# EAGLE design go-booster (EAGLE 7.6.0)
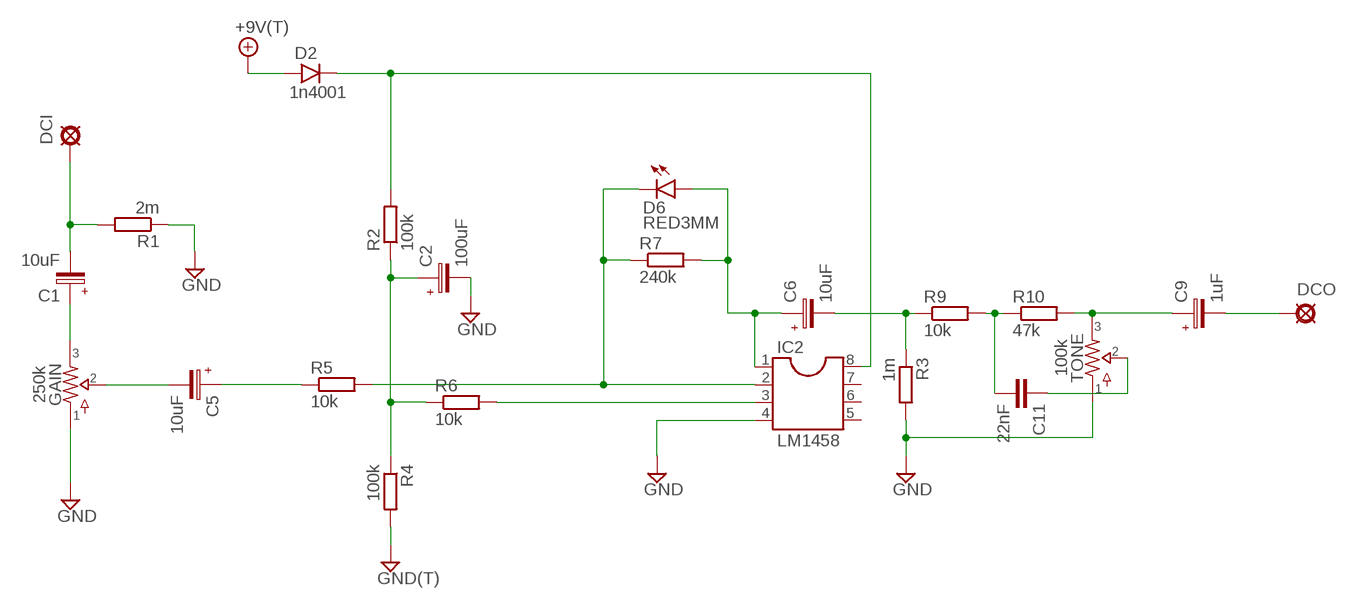
[diagram p0: schematic, sheet 1]

## Parts
+9V2  +9V(T)  [SQUARE]
C1  10uF  050-EU1  [050_020_1]
C2  100uF  050-EU1  [050_020_1]
C5  10uF  050-EU1  [050_020_1]
C6  10uF  050-EU1  [050_020_1]
C9  1uF  050-EU1  [050_020_1]
C11  22nF  072X0252  [072X025]
D2  1n4001  DO41.4  [DO41-4]
D6  RED3MM  LED3MM  [LED3MM]
DCI  IN  PAD8  [OCTOGON]
DCO  OUT  PAD8  [OCTOGON]
GAIN  250k  POTS  [16MM_CENTERMOUNT]
GND11  GND(T)  [SQUARE]
IC2  LM1458  DIL8S  [SOCKET-08]
R1  2m  R-EU_0207/10  [0207/10]
R2  100k  R-EU_0207/10  [0207/10]
R3  1m  R-EU_0207/10  [0207/10]
R4  100k  R-EU_0207/10  [0207/10]
R5  10k  R-EU_0207/10  [0207/10]
R6  10k  R-EU_0207/10  [0207/10]
R7  240k  R-EU_0207/10  [0207/10]
R9  10k  R-EU_0207/10  [0207/10]
R10  47k  R-EU_0207/10  [0207/10]
TONE  100k  POTSTRIM  [2262_TRIM]

## Nets
+9V: +9V2.1(+9V) D2.A
GND: C2.- GAIN.1 GND11.1(GND) IC2.4 R1.1 R3.2 R4.2 TONE.1
N$1: C1.+ GAIN.3
N$2: C1.- DCI.1(PAD) R1.2
N$5: D2.C IC2.8 R2.2
N$6: D6.K(C) IC2.2 R5.2 R7.1
N$7: IC2.3 R6.2
N$8: C6.+ D6.A IC2.1 R7.2
N$9: C5.- GAIN.2
N$10: C2.+ R2.1 R4.1 R6.1
N$11: C6.- R3.1 R9.1
N$13: C5.+ R5.1
N$17: C9.- DCO.1(PAD)
N$23: C11.2 R9.2 R10.1
N$24: C9.+ R10.2 TONE.3
N$25: C11.1 TONE.2
Unconnected: IC2.5 IC2.6 IC2.7

## Library data of the parts
+9V2 = gm-supply:+9V(T): +9V Voltage Supply use this to hook up +9v throughout a schematic instead of running wire automatically labels the net "+9v" adds a hookup pad to the circuit board
C1 C2 C5 C6 C9 = gm-caps-electro-pol:050-EU
C11 = gm-caps-film-box:072X025: 1000pF - 0.47uF WIMA MKP2 63, 100V: 1000pF - 0.015uF; MKS2 50V: 0.33 - 0.47uF; 63V: 1000pF - 0.22uF;
D2 = gm-diodes:DO41: DO-41 Package Diodes: 1N4001 - 1N40019 Zener Diodes: 1N4728 - 1N4764
D6 = gm-diodes:LED
DCI DCO = gm-supply:PAD: PAD use this package for pads with any purpose, including input, output, send or return various pad shapes: round, square, octogonal, long, and long offset
GAIN TONE = potentiometers:POTS
GND11 = gm-supply:GND(T): Ground use this to hook up ground (GND) throughout a schematic instead of running wire automatically labels the net "GND" adds a hookup pad to the circuit board (you can use several)
IC2 = ic-package:DIL8: Dual In Line / Socket
R1-R7 R9 R10 = resistor:R-EU_: RESISTOR, European symbol

## Board
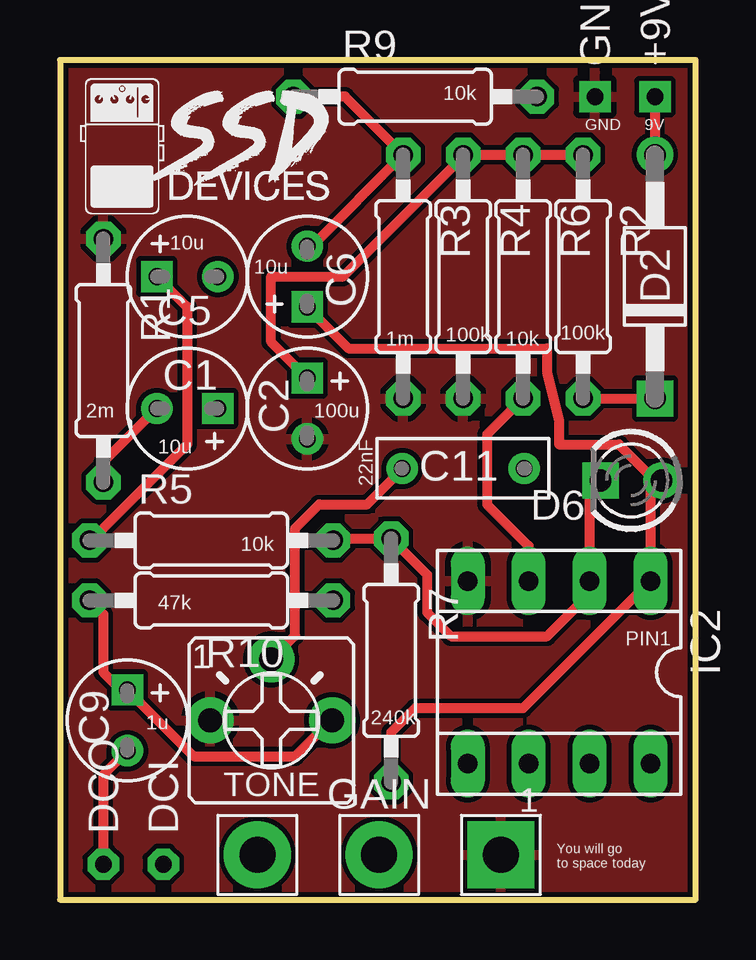
[diagram p1: board, top side]
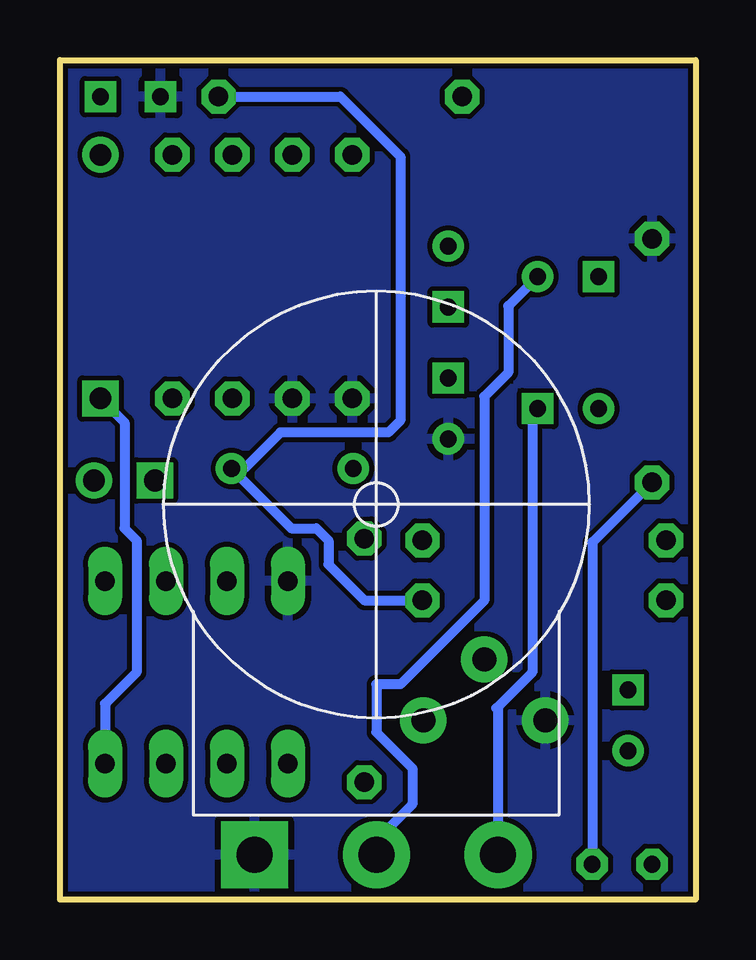
[diagram p2: board, bottom side, seen from below]

Size 26.5 x 35 mm. Coordinates in mm from the lower left corner, seen from the top.
Outline: 0,0 26.5,0 26.5,35 0,35 0,0
Copper layers (1*16): Top 0.035mm / dielectric 1.5mm / Bottom 0.035mm
Design rules "SparkFun": minimum track width 8mil, minimum drill 20mil, track to track 8mil, track to pad 8mil, pad to pad 8mil, via to via 8mil, smd to smd 8mil, copper to edge 8mil, drill to drill 8mil, minimum pad ring 12mil, minimum via ring 10mil, stop-mask expansion 4mil, vias tented up to drill 20mil, thermal gap 10mil

### Footprints (pad centres in the part's own frame; a part is rotated, then mirrored left to right if it is on the bottom)
SQUARE = drill 0.7 square: 1 0,0
050_020_1 = drill 0.7 square: + -1.27,0 | drill 0.7: - 1.27,0
072X025 = drill 0.7: 1 -2.54,0; 2 2.54,0
DO41-4 = drill 0.9: A 5.08,0 | drill 0.9 square: C -5.08,0
LED3MM = drill 0.9: A -1.27,0 | drill 0.9 square: K 1.27,0
OCTOGON = drill 0.7 octagon: 1 0,0
16MM_CENTERMOUNT = drill 1.5 pad 2.794 square: 1 5.08,-14.605 | drill 1.5 pad 2.794: 2 0,-14.605; 3 -5.08,-14.605
SOCKET-08 = drill 0.813 long: 1 -3.81,-3.81; 2 -1.27,-3.81; 3 1.27,-3.81; 4 3.81,-3.81; 5 3.81,3.81; 6 1.27,3.81; 7 -1.27,3.81; 8 -3.81,3.81
0207/10 = drill 0.813 octagon: 1 -5.08,0; 2 5.08,0
2262_TRIM = drill 1 pad 1.93: 1 -2.54,0; 2 0,2.54; 3 2.54,0

### Placement (x,y rotation side)
+9V2  24.81,33.47 90 top
C1  5.31,20.47 180 top
C2  10.31,20.47 270 top
C5  5.31,25.97 0 top
C6  10.31,25.97 90 top
C9  2.81,7.47 270 top
C11  16.81,17.97 0 top
D2  24.81,25.97 90 top
D6  23.81,17.47 180 top
DCI  4.31,1.47 90 top
DCO  1.81,1.47 90 top
GAIN  13.31,16.47 0 top
GND11  22.31,33.47 90 top
IC2  20.81,9.47 180 top
R1  1.81,22.47 270 top
R2  21.81,25.97 270 top
R3  14.31,25.97 270 top
R4  16.81,25.97 270 top
R5  6.31,14.97 0 top
R6  19.31,25.97 270 top
R7  13.81,9.97 270 top
R9  14.81,33.47 0 top
R10  6.31,12.47 180 top
TONE  8.81,7.47 0 top

### Tracks (layer width: path | path; a pad name or v marks a point on that pad's centre or on a via)
+9V
  Top 0.406: +9V2.1 D2.A
GND
  pour Top: 0,0 0,35 26.5,35 26.5,0
  pour Bottom: 0,0 0,35 26.5,35 26.5,0
N$1
  Bottom 0.406: C1.+ 6.81,20.24 6.81,9.47 8.31,7.97 8.23,7.89 GAIN.3
N$2
  Top 0.406: C1.- 1.81,18.24 R1.2
  Bottom 0.406: R1.2 4.31,14.89 DCI.1
N$5
  Top 0.406: R2.2 D2.C
  Bottom 0.406: D2.C 23.81,19.89 23.81,15.47 23.31,14.97 23.31,9.47 24.62,8.16 IC2.8
N$6
  Top 0.406: D6.K 22.08,17.01 IC2.2 22.08,12.74 20.31,10.97 16.31,10.97 15.31,11.97 15.31,13.55 R7.1 11.47,15.05 R5.2
N$7
  Top 0.406: R6.2 17.81,19.39 17.81,16.47 19.54,14.74 IC2.3
N$8
  Top 0.406: R7.2 13.81,6.97 14.81,7.97 19.31,7.97 IC2.1 24.62,17.01 D6.A 24.81,17.47 23.31,18.97 20.81,18.97 20.81,19.97 20.31,21.97 20.31,22.97 12.04,22.97 C6.+
N$9
  Bottom 0.406: C5.- 7.81,24.74 7.81,21.97 8.81,20.97 8.81,12.47 12.31,8.97 13.31,8.97 13.31,6.97 11.81,5.47 11.81,3.97 13.31,2.47 GAIN.2
N$10
  Top 0.406: C2.+ 8.81,23.24 8.81,25.97 11.81,25.97 16.81,30.97 R4.1 R6.1 R2.1
N$11
  Top 0.406: R9.1 11.89,33.47 R3.1 10.5,27.24 C6.-
N$13
  Top 0.406: C5.+ 5.31,24.7 5.31,18.97 1.31,14.97 R5.1
N$17
  Top 0.406: C9.- 1.81,5.2 DCO.1
N$23
  Bottom 0.406: R9.2 14.81,33.47 12.31,30.97 12.31,19.97 12.81,19.47 17.31,19.47 18.81,17.97 C11.2 16.85,15.47 15.81,15.47 15.31,14.97 15.31,13.97 13.81,12.47 R10.1
N$24
  Top 0.406: R10.2 1.81,11.89 1.81,9.47 2.54,8.74 C9.+ 5.58,5.97 9.81,5.97 11.31,7.47 TONE.3
N$25
  Top 0.406: TONE.2 9.81,11.01 9.81,15.47 10.81,16.47 12.81,16.47 14.27,17.93 C11.1

### Text on the board
tPlace: 10k | GND | 9V | 10u | 10u | 1m | 100k | 10k | 100k | 2m | 100u | 10u | 22nF | 10k | 47k | PIN1 | 1u | 240k | You will go / to space today | /Users/the_frey/Documents/Pedal Building/ssddevices.bmp
200bmp: /Users/the_frey/Documents/Pedal Building/Enclosure 125B_V82_TZ-01.bmp